# EAGLE schematic TZATZIKI_v1 (EAGLE 7.6.0)
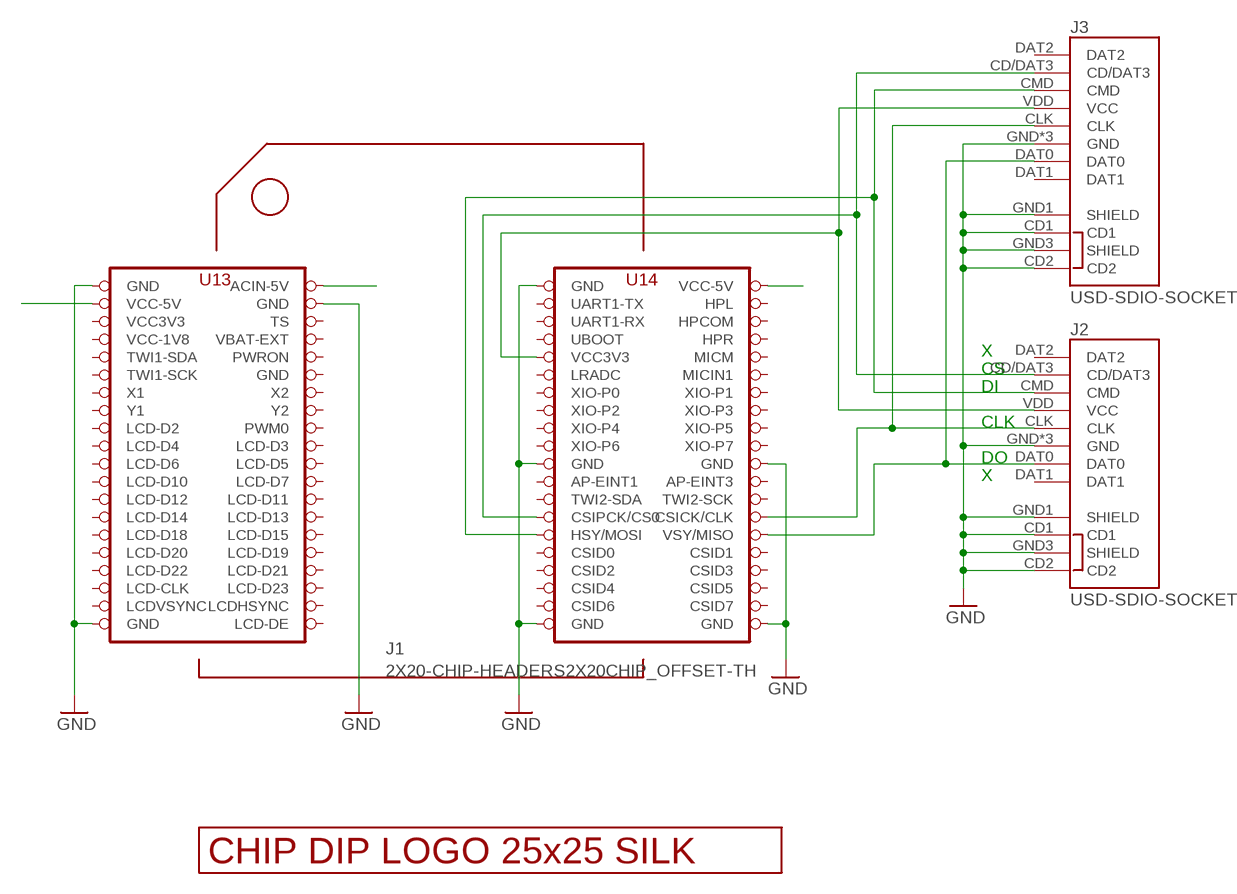
[diagram p0: schematic, sheet 1]

## Parts
J1  2X20-CHIP-HEADERS2X20CHIP_OFFSET-TH  [2X20CHIP_OFFSET-TH]
J2  USD-SDIO-SOCKET  [MICRO-SD-SOCKET-SDIO]
J3  USD-SDIO-SOCKET  [MICRO-SD-SOCKET-SDIO]
U$1  LOGO_25X25_SILK  [LOGO_25X25_SILK]

## Nets
GND: J1.GND@1(GND) J1.GND@2(GND) J1.GND@4(GND) J1.GND@5(GND) J1.GND@6(GND) J1.GND@7(GND) J1.GND@8(GND) J1.GND@10(GND) J2.CD1 J2.CD2 J2.GND J2.GND1(SHIELD) J2.GND3(SHIELD) J2.GND@1(GND) J2.GND@2(GND) J3.CD1 J3.CD2 J3.GND J3.GND1(SHIELD) J3.GND3(SHIELD) J3.GND@1(GND) J3.GND@2(GND)
N$1: J1.CHG-IN(ACIN-5V)
N$2: J1.CSIPCK(CSIPCK/CS0) J2.CD/DAT3 J3.CD/DAT3
N$3: J1.CSIVSYNC(VSY/MISO) J2.DAT0 J3.DAT0
N$4: J1.CSIHSYNC(HSY/MOSI) J2.CMD J3.CMD
N$5: J1.CSICK(CSICK/CLK) J2.CLK J3.CLK
N$6: J1.VCC3V3@1(VCC3V3) J2.VDD(VCC) J3.VDD(VCC)
N$7: J1.VCC5V@1(VCC-5V)
N$8: J1.VCC5V@0(VCC-5V)
Unconnected: J1.AP-EINT1 J1.AP-EINT3 J1.BAT(VBAT-EXT) J1.CSID0 J1.CSID1 J1.CSID2 J1.CSID3 J1.CSID4 J1.CSID5 J1.CSID6 J1.CSID7 J1.FEL(UBOOT) J1.HPCOM J1.HPL J1.HPR J1.LCD-CLK J1.LCD-D2 J1.LCD-D3 J1.LCD-D4 J1.LCD-D5 J1.LCD-D6 J1.LCD-D7 J1.LCD-D10 J1.LCD-D11 J1.LCD-D12 J1.LCD-D13 J1.LCD-D14 J1.LCD-D15 J1.LCD-D18 J1.LCD-D19 J1.LCD-D20 J1.LCD-D21 J1.LCD-D22 J1.LCD-D23 J1.LCD-DE J1.LCD-HSYNC(LCDHSYNC) J1.LCD-VSYNC(LCDVSYNC) J1.LRADC J1.MICIN1 J1.MICM J1.PWM0 J1.PWRON J1.TS J1.TWI1-SCK J1.TWI1-SDA J1.TWI2-SCK J1.TWI2-SDA J1.UART1-RX J1.UART1-TX J1.X1 J1.X2 J1.XIO-P0 J1.XIO-P1 J1.XIO-P2 J1.XIO-P3 J1.XIO-P4 J1.XIO-P5 J1.XIO-P6 J1.XIO-P7 J1.Y1 J1.Y2 J2.DAT1 J2.DAT2 J3.DAT1 J3.DAT2

## Notes on the sheet
- X
- CS
- DI
- CLK
- DO
- X

## Power pins joined to a net without a drawn wire
GND: J1.GND@3(GND)
VCC3V3: J1.VCC3V3
VCC-1V8: J1.VCC1V8(VCC-1V8)

## Library data of the parts
J1 = JKW_CHIP:2X20-CHIP-HEADERS: Through hole layout with chip reference
J2 J3 = JKW_CHIP:USD-SDIO-SOCKET: microSD Socket Push-push type uSD socket with full SDIO signal mapping. Spark Fun Electronics SKU : PRT-00127. tDoc lines correctly indicate media card edge positions when inserting (unlocked, locked, depressed). NOTE: CD1 and CD2 are connected internally, and short to ground when card is removed.; PROD_ID: SCHD3A0100
U$1 = JKW_CHIP:LOGO_25X25_SILK